# EAGLE schematic SpdReaderWriterSchematic (EAGLE 9.6.2)
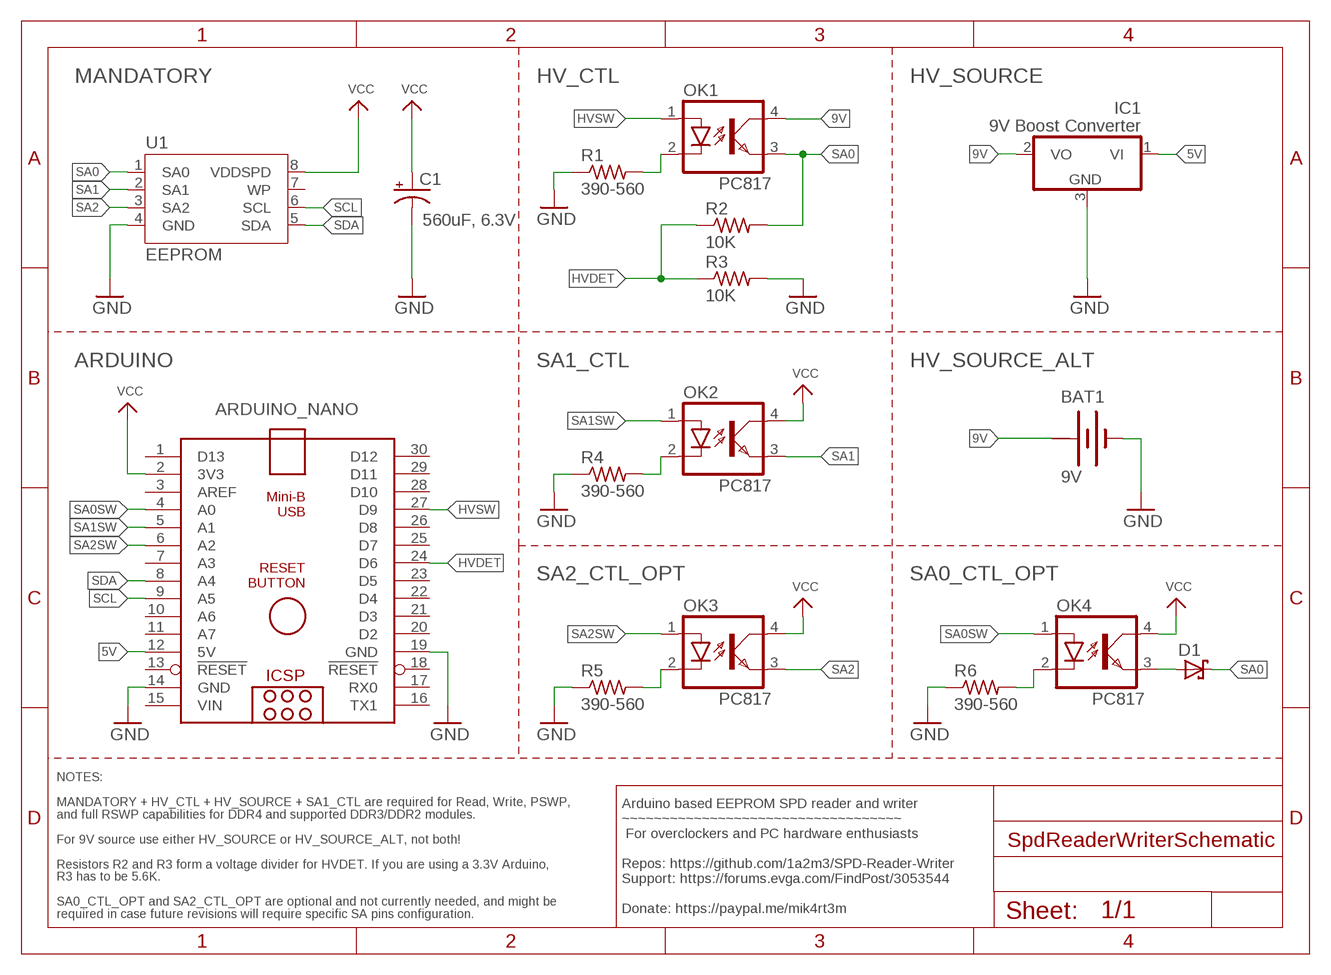
[diagram p0: schematic, sheet 1]

## Parts
ARDUINO_NANO  ARDUINO_NANO  [ARDUINO_NANO]
BAT1  9V  BATTERY  [BATTERY]
C1  560uF, 6.3V  CPOL-USE5-8.5  [E5-8,5]
D1  SCHOTTKY-DIODEDO35-7  [DO35-7]
IC1  9V Boost Converter  7824H  [TO39]
OK1  PC817  LTV816  [DIL04]
OK2  PC817  LTV816  [DIL04]
OK3  PC817  LTV816  [DIL04]
OK4  PC817  LTV816  [DIL04]
R1  390-560  R-US_0204/7  [0204/7]
R2  10K  R-US_0204/7  [0204/7]
R3  10K  R-US_0204/7  [0204/7]
R4  390-560  R-US_0204/7  [0204/7]
R5  390-560  R-US_0204/7  [0204/7]
R6  390-560  R-US_0204/7  [0204/7]
U1  EEPROM  [2X04]

## Nets
5V: ARDUINO_NANO.12(5V) IC1.1(VI)
9V: BAT1.+ IC1.2(VO) OK1.4(COL)
GND: ARDUINO_NANO.14(GND) ARDUINO_NANO.19(GND) BAT1.- C1.- IC1.3(GND) R1.1 R3.2 R4.1 R5.1 R6.1 U1.4(GND)
HVDET: ARDUINO_NANO.24(D6) R2.1 R3.1
HVSW: ARDUINO_NANO.27(D9) OK1.1(A)
N$1: OK1.2(C) R1.2
N$2: OK3.2(C) R5.2
N$3: OK4.2(C) R6.2
N$4: OK2.2(C) R4.2
N$5: D1.A OK4.3(EMIT)
SA0: D1.C OK1.3(EMIT) R2.2 U1.1(SA0)
SA0SW: ARDUINO_NANO.4(A0) OK4.1(A)
SA1: OK2.3(EMIT) U1.2(SA1)
SA1SW: ARDUINO_NANO.5(A1) OK2.1(A)
SA2: OK3.3(EMIT) U1.3(SA2)
SA2SW: ARDUINO_NANO.6(A2) OK3.1(A)
SCL: ARDUINO_NANO.9(A5) U1.6(SCL)
SDA: ARDUINO_NANO.8(A4) U1.5(SDA)
VCC: ARDUINO_NANO.2(3V3) C1.+ OK2.4(COL) OK3.4(COL) OK4.4(COL) U1.8(VDDSPD)
Unconnected: ARDUINO_NANO.1(D13) ARDUINO_NANO.3(AREF) ARDUINO_NANO.7(A3) ARDUINO_NANO.10(A6) ARDUINO_NANO.11(A7) ARDUINO_NANO.13(!RESET) ARDUINO_NANO.16(TX1) ARDUINO_NANO.17(RX0) ARDUINO_NANO.18(!RESET) ARDUINO_NANO.20(D2) ARDUINO_NANO.21(D3) ARDUINO_NANO.22(D4) ARDUINO_NANO.23(D5) ARDUINO_NANO.25(D7) ARDUINO_NANO.26(D8) ARDUINO_NANO.28(D10) ARDUINO_NANO.29(D11) ARDUINO_NANO.30(D12) U1.7(WP)

## Notes on the sheet
- MANDATORY | HV_CTL | HV_SOURCE
- ARDUINO | SA1_CTL | HV_SOURCE_ALT
- SA2_CTL_OPT | SA0_CTL_OPT
- Arduino based EEPROM SPD reader and writer
  ~~~~~~~~~~~~~~~~~~~~~~~~~~~~~~~~~~~
   For overclockers and PC hardware enthusiasts
  
  Repos: https://github.com/1a2m3/SPD-Reader-Writer
  Support: https://forums.evga.com/FindPost/3053544
  
  Donate: https://paypal.me/mik4rt3m
- NOTES:
  
  MANDATORY + HV_CTL + HV_SOURCE + SA1_CTL are required for Read, Write, PSWP, 
  and full RSWP capabilities for DDR4 and supported DDR3/DDR2 modules. 
  
  For 9V source use either HV_SOURCE or HV_SOURCE_ALT, not both\!
  
  Resistors R2 and R3 form a voltage divider for HVDET. If you are using a 3.3V Arduino, 
  R3 has to be 5.6K.
  
  SA0_CTL_OPT and SA2_CTL_OPT are optional and not currently needed, and might be 
  required in case future revisions will require specific SA pins configuration.

## Power pins joined to a net without a drawn wire
+: BAT1.+@1(+)
VIN: ARDUINO_NANO.15(VIN)

## Library data of the parts
ARDUINO_NANO = ArduinoNanoV30:ARDUINO_NANO: Arduino Nano V3.0 Overview: The Arduino Nano is a small, complete, and breadboard-friendly board based on the ATmega328 (Arduino Nano 3.x) or ATmega168 (Arduino Nano 2.x). It has more or less the same functionality of the Arduino Duemilanove, but in a different package. It lacks only a DC power jack, and works with a Mini-B USB cable instead of a standard one. The Nano was designed and is being produced by Gravitech. Specifications: Microcontroller Atmel ATmega168 or ATmega328 Operating Voltage (logic level) 5 V Input Voltage (recommended) 7-12 V Input Voltage (limits) 6-20 V Digital I/O Pins 14 (of which 6 provide PWM output) Analog Input Pins 8 DC Current per I/O Pin 40 mA Flash Memory 16 KB (ATmega168) or 32 KB (ATmega328) of which 2 KB used by bootloader SRAM 1 KB (ATmega168) or 2 KB (ATmega328) EEPROM 512 bytes (ATmega168) or 1 KB (ATmega328) Clock Speed 16 MHz Dimensions 0.73" x 1.70" Length 45 mm Width 18 mm Weigth 5 g Power: The Arduino Nano can be powered via the Mini-B USB connection, 6-20V unregulated external power supply (pin 30), or 5V regulated external power supply (pin 27). The power source is automatically selected to the highest voltage source. Memory: The ATmega168 has 16 KB of flash memory for storing code (of which 2 KB is used for the bootloader); the ATmega328 has 32 KB, (also with 2 KB used for the bootloader). The ATmega168 has 1 KB of SRAM and 512 bytes of EEPROM (which can be read and written with the EEPROM library); the ATmega328 has 2 KB of SRAM and 1 KB of EEPROM. Input and Output: Each of the 14 digital pins on the Nano can be used as an input or output, using pinMode(), digitalWrite(), and digitalRead() functions. They operate at 5 volts. Each pin can provide or receive a maximum of 40 mA and has an internal pull-up resistor (disconnected by default) of 20-50 kOhms. In addition, some pins have specialized functions. Visit Arduino - ArduinoBoardNano <https://www.arduino.cc/en/Main/ArduinoBoardNano>
BAT1 = special:BATTERY: BATTERY
C1 = rcl:CPOL-US: POLARIZED CAPACITOR, American symbol; SPICEPREFIX: C
D1 = adafruit:SCHOTTKY-DIODE: Schottky Diode
IC1 = adafruit:78*: Positive VOLTAGE REGULATOR Added bigger pads to the TO-92 package
OK1-OK4 = optocoupler:LTV816: OPTO COUPLER Source: LITEON, LTV816.pdf; OC_FARNELL: unknown; OC_NEWARK: unknown
R1 R4-R6 = rcl:R-US_: RESISTOR, American symbol; SPICEPREFIX: R
R2 R3 = adafruit:R-US_: RESISTOR, American symbol
U1 = EEPROM:EEPROM: EEPROM